# EAGLE design transmitter (EAGLE 7.3.0)
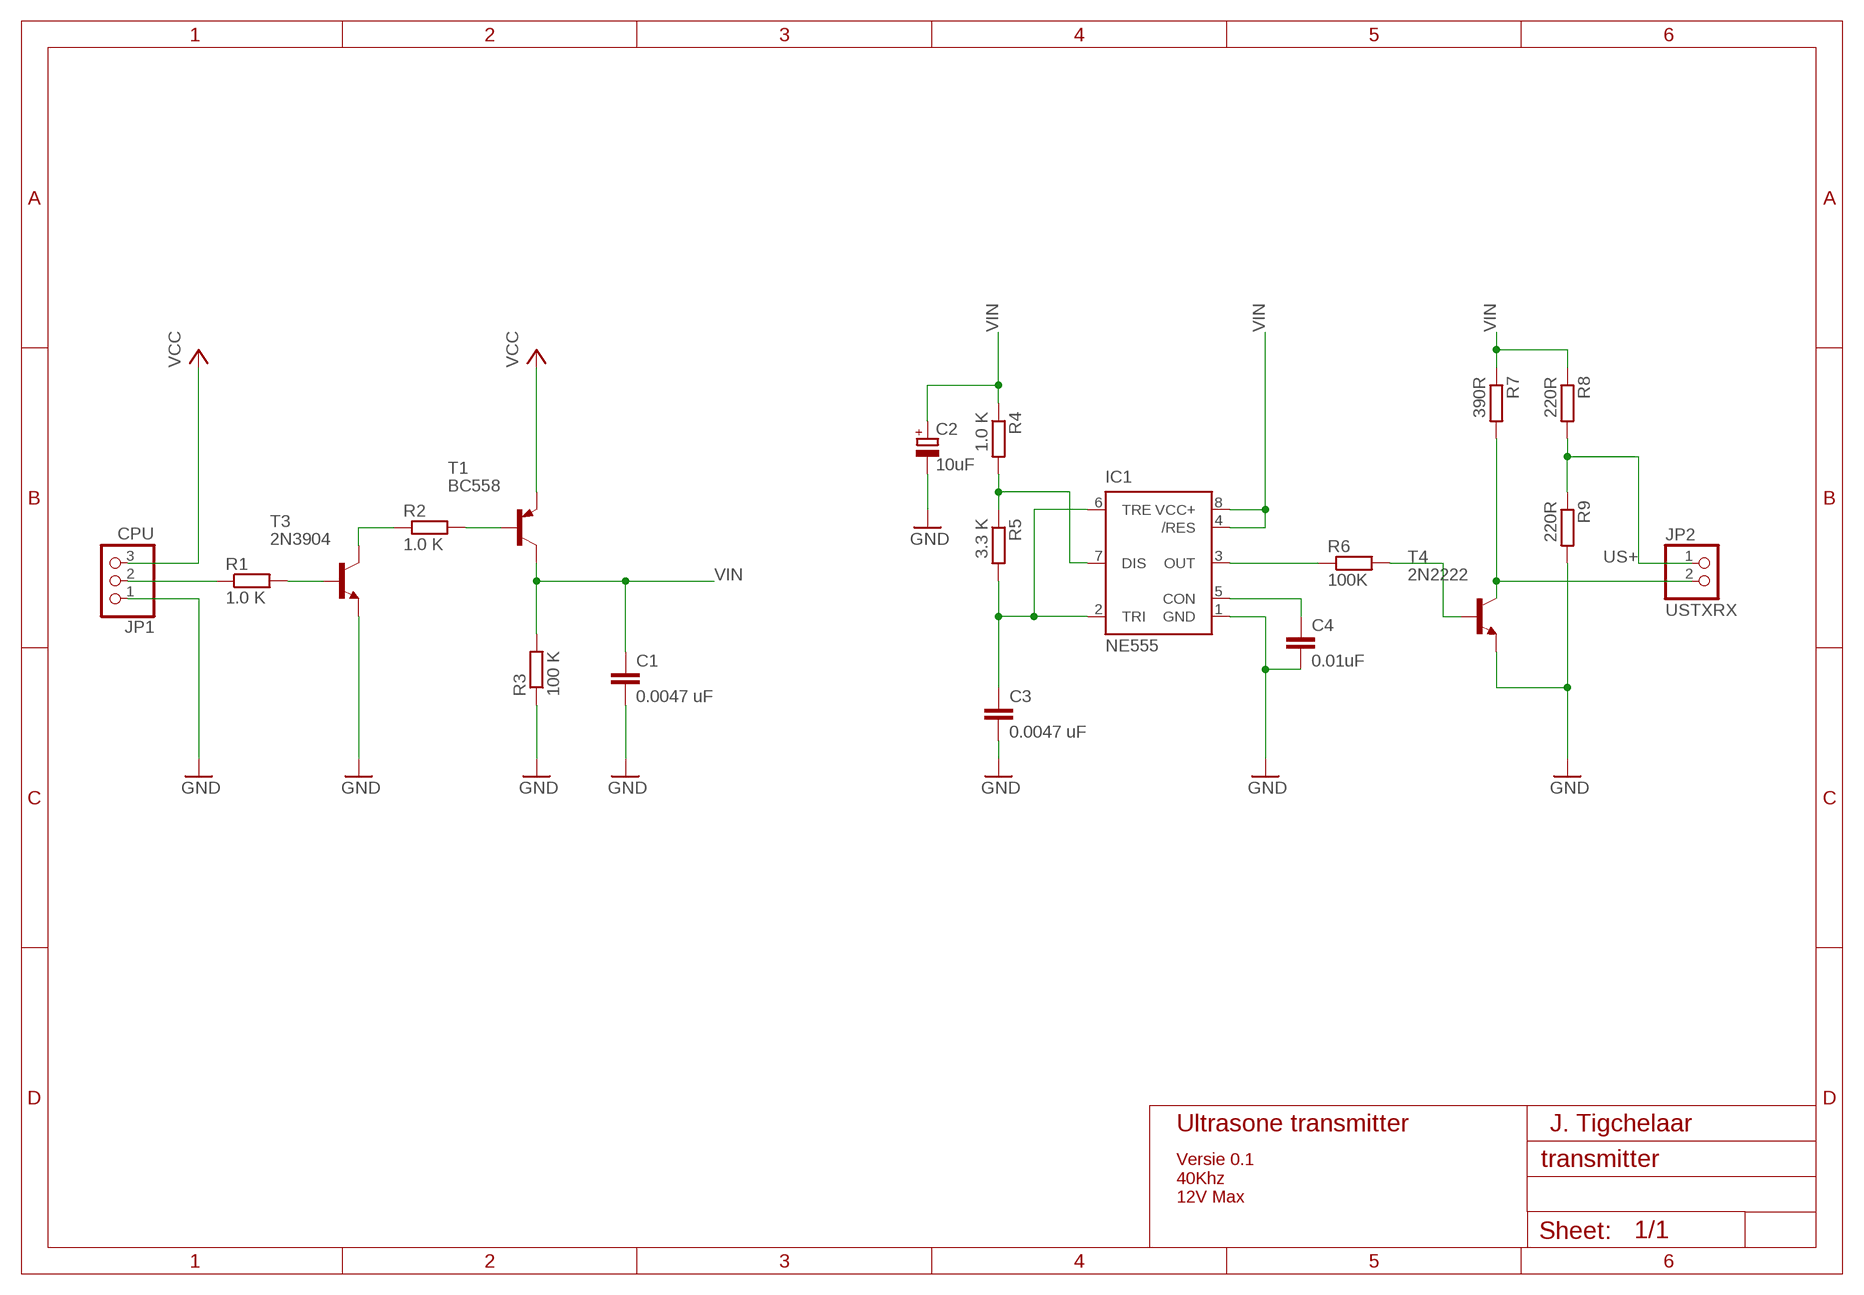
[diagram p0: schematic, sheet 1]

## Parts
C1  0.0047 uF  C-EU025-025X050  [C025-025X050]
C2  10uF  CPOL-EUE5-5  [E5-5]
C3  0.0047 uF  C-EU025-025X050  [C025-025X050]
C4  0.01uF  C-EU025-025X050  [C025-025X050]
IC1  NE555  [DIL-08]
JP1  CPU  PINHD-1X3  [1X03]
JP2  USTXRX  PINHD-1X2  [1X02]
R1  1.0 K  R-EU_0207/10  [0207/10]
R2  1.0 K  R-EU_0207/10  [0207/10]
R3  100 K  R-EU_0207/10  [0207/10]
R4  1.0 K  R-EU_0207/10  [0207/10]
R5  3.3 K  R-EU_0207/10  [0207/10]
R6  100K  R-EU_0207/10  [0207/10]
R7  390R  R-EU_0207/10  [0207/10]
R8  220R  R-EU_0207/10  [0207/10]
R9  220R  R-EU_0207/10  [0207/10]
T1  BC558  2N4126-PNP-TO92-CBE  [TO92-CBE]
T3  2N3904  2N3904-NPN-TO92-EBC  [TO92-EBC]
T4  2N2222  2N2222-NPN-TO92-EBC  [TO92-EBC]

## Nets
GND: C1.2 C2.- C3.2 C4.2 IC1.1(GND) JP1.1 R3.1 R9.2 T3.E T4.E
N$1: C4.1 IC1.5(CON)
N$2: C3.1 IC1.2(TRI) IC1.6(TRE) R5.2
N$3: IC1.7(DIS) R4.2 R5.1
N$4: R6.2 T4.B
N$5: JP1.2 R1.1
N$6: IC1.3(OUT) R6.1
N$7: JP2.2 R7.2 T4.C
N$8: R1.2 T3.B
N$9: R2.1 T3.C
N$10: R2.2 T1.B
US+: JP2.1 R8.2 R9.1
VCC: JP1.3 T1.E
VIN: C1.1 C2.+ IC1.4(/RES) IC1.8(VCC+) R3.2 R4.1 R7.1 R8.1 T1.C

## Notes on the sheet
- Ultrasone transmitter | J. Tigchelaar
- Versie 0.1
  40Khz
  12V Max

## Library data of the parts
C1 C3 C4 = rcl:C-EU: CAPACITOR, European symbol
C2 = rcl:CPOL-EU: POLARIZED CAPACITOR, European symbol
IC1 = st-microelectronics:NE555: General purpose bipolar Timer; MF: Arrow Electronics; MPN: NE555N; OC_FARNELL: 1467742; OC_NEWARK: 89K1486
JP1 = pinhead:PINHD-1X3: PIN HEADER
JP2 = pinhead:PINHD-1X2: PIN HEADER
R1-R9 = resistor:R-EU_: RESISTOR, European symbol
T1 = transistor:*-PNP-: PNP Transistror
T3 T4 = transistor-neu-to92:*-NPN-: NPN Transistror

## Board
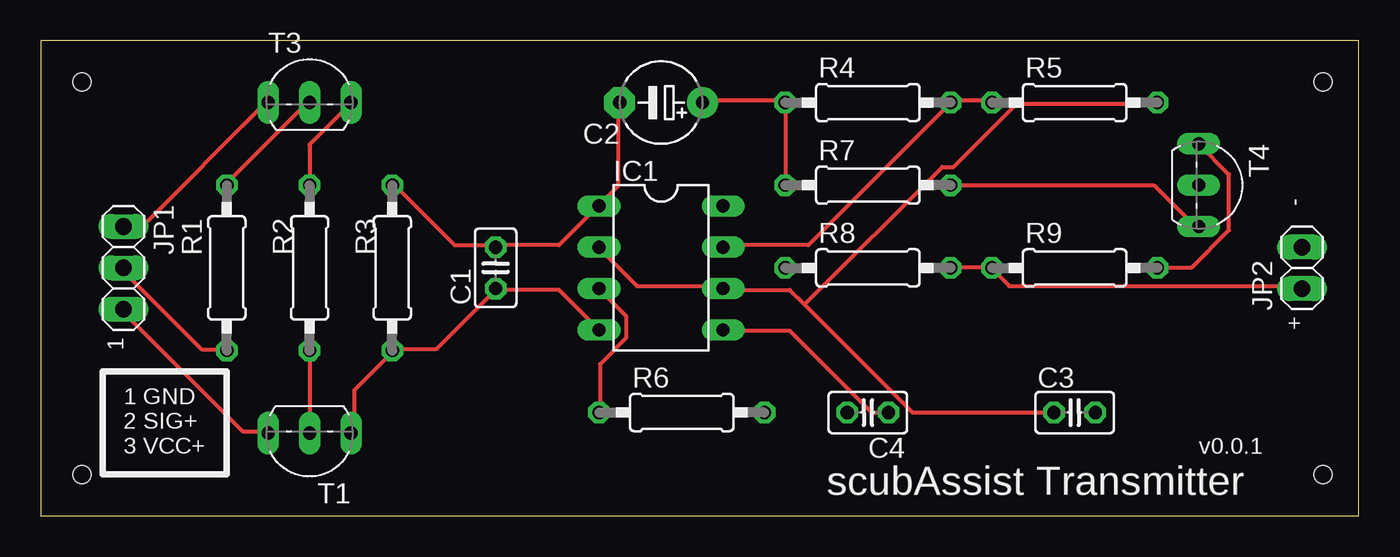
[diagram p1: board, top side]
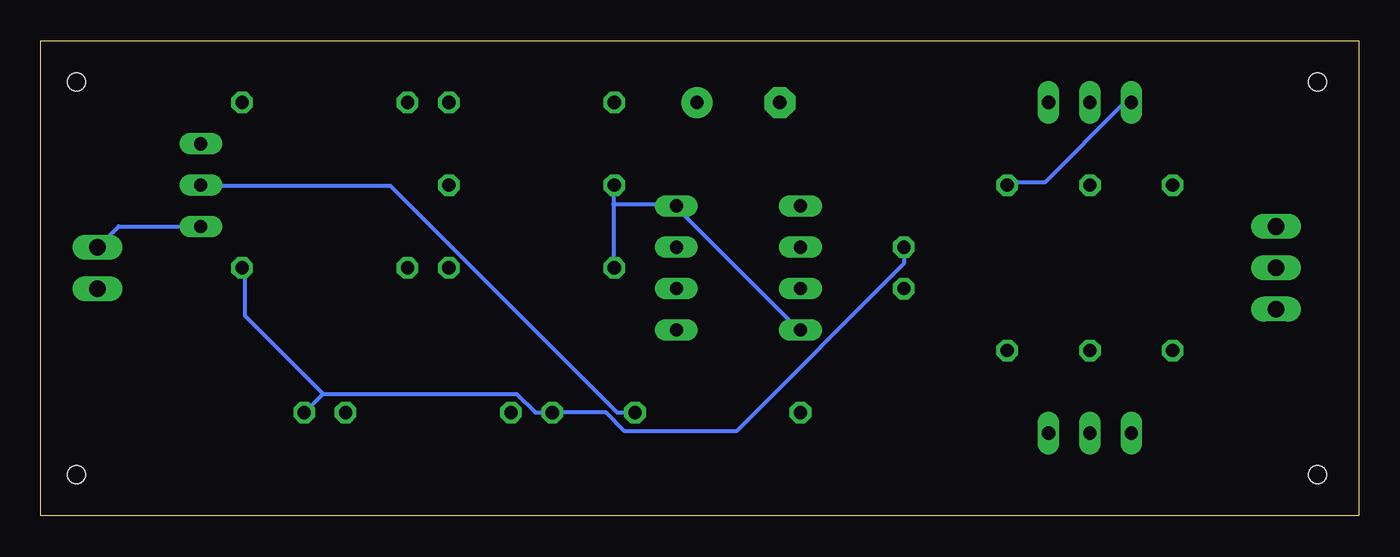
[diagram p2: board, bottom side, seen from below]

Size 80.95 x 29.2 mm. Coordinates in mm from the lower left corner, seen from the top.
Outline: 0,0 80.95,0 80.95,29.2 0,29.2 0,0
Copper layers (1*16): Top 0.035mm / dielectric 1.5mm / Bottom 0.035mm
Design rules "default": minimum track width 10mil, minimum drill 24mil, track to track 8mil, track to pad 8mil, pad to pad 8mil, via to via 8mil, smd to smd 8mil, copper to edge 40mil, drill to drill 8mil, minimum pad ring 10mil, minimum via ring 8mil, stop-mask expansion 4mil, vias tented up to drill 0mil, thermal gap 10mil
Holes 1.1 mm at 2.54,2.54 2.54,26.67 78.74,26.67 78.74,2.54

### Footprints (pad centres in the part's own frame; a part is rotated, then mirrored left to right if it is on the bottom)
C025-025X050 = drill 0.813 octagon: 1 -1.27,0; 2 1.27,0
E5-5 = drill 0.813 pad 1.905: + -2.54,0 | drill 0.813 pad 1.905 octagon: - 2.54,0
DIL-08 = drill 0.813 long: 1 -3.81,-3.81; 2 -1.27,-3.81; 3 1.27,-3.81; 4 3.81,-3.81; 5 3.81,3.81; 6 1.27,3.81; 7 -1.27,3.81; 8 -3.81,3.81
1X03 = drill 1.016 long: 1 -2.54,0; 2 0,0; 3 2.54,0
1X02 = drill 1.016 long: 1 -1.27,0; 2 1.27,0
0207/10 = drill 0.813 octagon: 1 -5.08,0; 2 5.08,0
TO92-CBE = drill 0.813 long: B 0,0; C -2.54,0; E 2.54,0
TO92-EBC = drill 0.813 long: B 0,-1.27; C 2.54,-1.27; E -2.54,-1.27

### Placement (x,y rotation side)
C1  27.94,15.24 90 top
C2  38.1,25.4 180 top
C3  63.5,6.35 0 top
C4  50.8,6.35 180 top
IC1  38.1,15.24 270 top
JP1  5.08,15.24 270 top
JP2  77.47,15.24 90 top
R1  11.43,15.24 90 top
R2  16.51,15.24 270 top
R3  21.59,15.24 270 top
R4  50.8,25.4 0 top
R5  63.5,25.4 0 top
R6  39.37,6.35 0 top
R7  50.8,20.32 0 top
R8  50.8,15.24 0 top
R9  63.5,15.24 0 top
T1  16.51,5.08 180 top
T3  16.51,26.67 0 top
T4  72.39,20.32 270 top

### Tracks (layer width: path | path; a pad name or v marks a point on that pad's centre or on a via)
GND
  Top 0.254: T4.E 71.14,22.81 72.97,20.98 72.97,17.55 70.69,15.26 68.63,15.26 R9.2 | 27.94,16.64 31.83,16.64 34.11,18.92 IC1.1 34.34,19.15 35.48,20.29 35.48,25.32 C2.- | JP1.1 6.22,17.78 13.77,25.32 T3.E | 27.94,16.64 25.42,16.64 21.77,20.29 R3.1 | 27.94,16.64 C1.2
  Bottom 0.254: 63.6,7.49 51.71,7.49 50.57,6.35 C4.2 46.23,6.35 45.09,5.21 38.23,5.21 27.94,15.49 C1.2 | 63.6,7.49 64.75,6.35 C3.2 | 63.6,7.49 68.4,12.29 68.4,15.04 R9.2 | T3.E 13.99,25.32 14.45,25.32 19.25,20.52 21.54,20.52 R3.1
N$1
  Top 0.254: C4.1 51.03,6.35 46,11.38 42.11,11.38 IC1.5
N$2
  Top 0.254: IC1.2 34.34,16.41 36.63,14.12 41.88,14.12 IC1.6 42.11,13.89 46,13.89 46.91,12.98 | C3.1 53.54,6.35 46.91,12.98 | 46.91,12.98 55.37,21.44 56.06,21.44 59.94,25.32 68.4,25.32 R5.2
N$3
  Top 0.254: IC1.7 42.11,16.64 47.14,16.64 55.83,25.32 R4.2 56.06,25.55 58.34,25.55 R5.1
N$4
  Bottom 0.254: R6.2 45.54,6.35 59.49,20.29 70.92,20.29 T4.B
N$5
  Top 0.254: R1.1 11.25,10.24 9.88,10.24 5.08,15.04 JP1.2
N$6
  Top 0.254: R6.1 34.34,6.35 34.34,9.32 35.94,10.92 35.94,12.29 34.34,13.89 IC1.3
N$7
  Top 0.254: R7.2 56.06,20.29 68.4,20.29 70.92,17.78 T4.C
  Bottom 0.254: T4.C 76.17,17.78 77.32,16.64 JP2.2
N$8
  Top 0.254: R1.2 11.48,20.52 16.51,25.55 T3.B
N$9
  Top 0.254: R2.1 16.51,22.81 19.02,25.32 T3.C
N$10
  Top 0.254: R2.2 T1.B
US+
  Top 0.254: R8.2 56.06,15.26 58.34,15.26 R9.1 58.57,15.04 59.49,14.12 77.32,14.12 JP2.1
VCC
  Top 0.254: T1.E 13.77,5.21 12.39,5.21 5.08,12.52 JP1.3
VIN
  Top 0.254: C2.+ 40.74,25.55 45.54,25.55 R4.1 45.77,25.32 45.77,20.52 R7.1 | T1.C 19.25,5.21 19.25,7.72 21.54,10.01 R3.2 21.77,10.24 24.28,10.24 27.94,13.89 | 27.94,13.89 31.83,13.89 IC1.4 | 27.94,13.89 C1.1
  Bottom 0.254: 45.77,19.15 45.77,20.29 R7.1 | 45.77,19.15 45.77,15.26 R8.1 | 45.77,19.15 42.11,19.15 IC1.8 41.88,18.92 34.34,11.38 IC1.4

### Text on the board
tPlace: - | + | 1 | 1 GND / 2 SIG+ / 3 VCC+ | v0.0.1 | scubAssist Transmitter